# Altium schematic sheet debugging_board_3_MCU.SchDoc
size A4
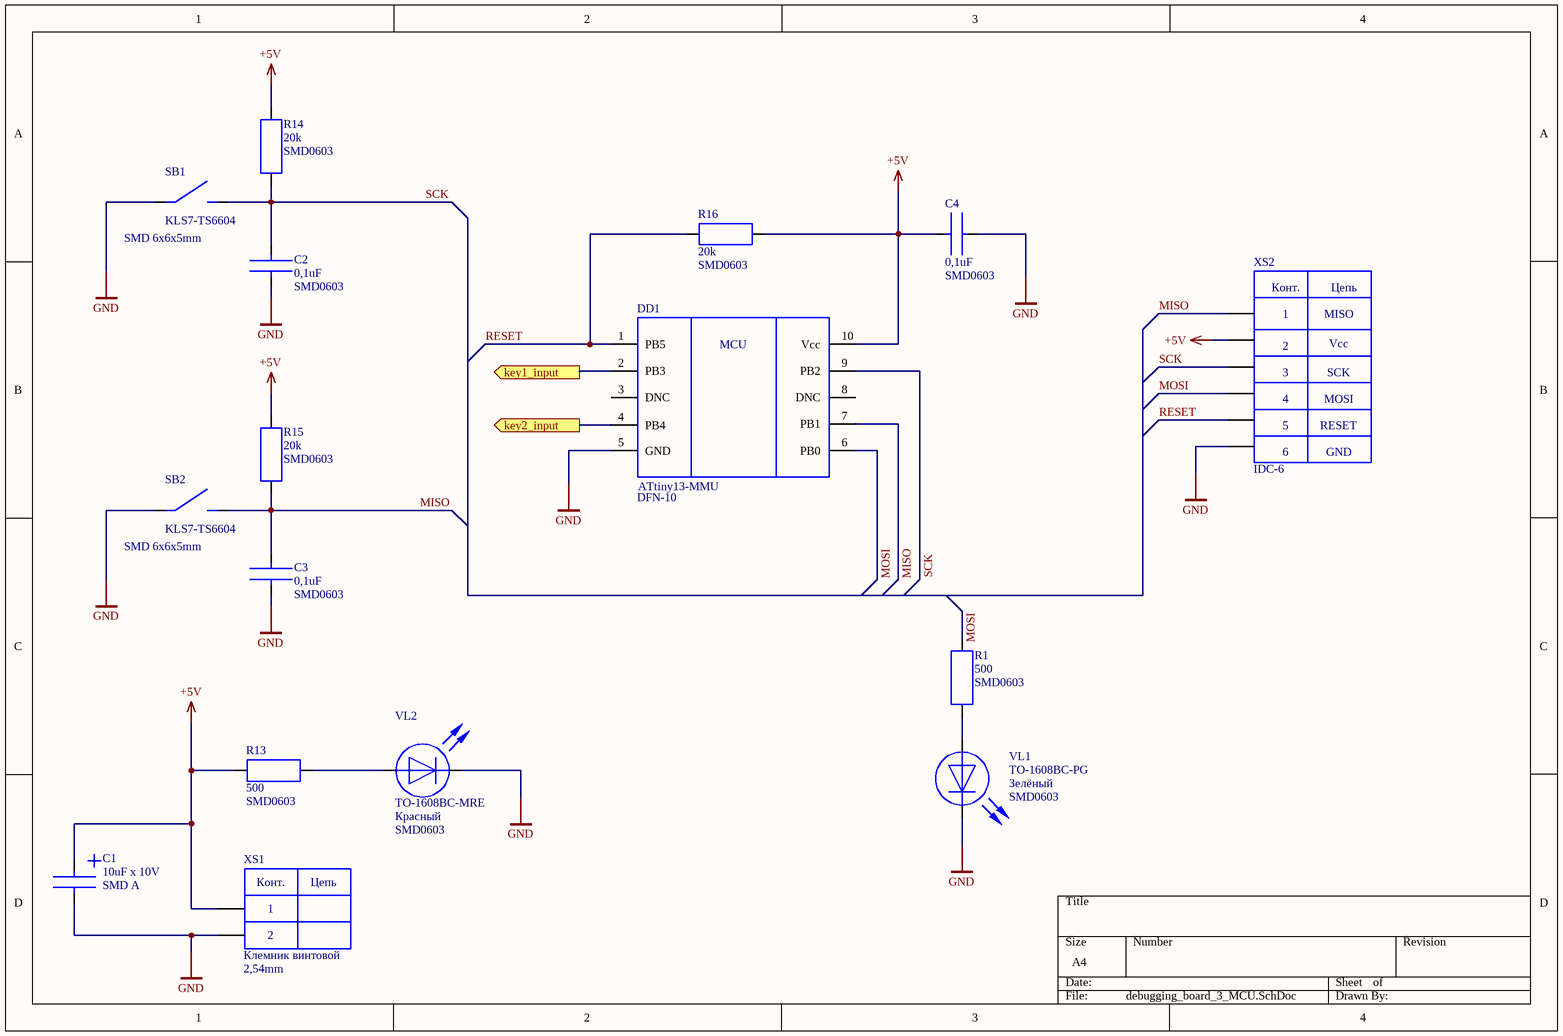
[diagram p0: debugging_board_3_MCU.SchDoc]

## Parts
C1  10uF x 10V  Package: SMD A  [TANT_CAP_A(3216)]
C2  0,1uF  Package: SMD0603  [SMD0603(1005)]
C3  0,1uF  Package: SMD0603  [SMD0603(1005)]
C4  0,1uF  Package: SMD0603  [SMD0603(1005)]
DD1  ATtiny13-MMU  Package: DFN-10  [QFN-10]
R1  500  Package: SMD0603  [SMD0603(1005)]
R13  500  Package: SMD0603  [SMD0603(1005)]
R14  20k  Package: SMD0603  [SMD0603(1005)]
R15  20k  Package: SMD0603  [SMD0603(1005)]
R16  20k  Package: SMD0603  [SMD0603(1005)]
SB1  KLS7-TS6604  Package: SMD 6х6х5mm  [KLS7-TS6604 (IT-1102SA)]
SB2  KLS7-TS6604  Package: SMD 6х6х5mm  [KLS7-TS6604 (IT-1102SA)]
VL1  TO-1608BC-PG  Light: Зелёный  Package: SMD0603  [LED_SMD0603(1005)]
VL2  TO-1608BC-MRE  Light: Красный  Package: SMD0603  [LED_SMD0603(1005)]
XS1  Клемник винтовой  Package: 2,54mm  [XS_2x2.54MM]
XS2  IDC-6  [IDC-6 (2.54)]

## Ports
key1_input (out), key2_input (out)

## Nets
+5V: C1.1 C4.1 DD1.10(Vcc) R13.1 R14.2 R15.2 R16.2 XS1.1 XS2.2(DM-)
GND: C1.2 C2.1 C3.1 C4.2 DD1.5(GND) SB1.1 SB2.1 VL1.2 VL2.2 XS1.2 XS2.6(DM+)
key1_input: DD1.2(PB3) ; port key1_input
key2_input: DD1.4(PB4) ; port key2_input
MISO: C3.2 DD1.7(PB1) R15.1 SB2.2 XS2.1(+5)
MOSI: DD1.6(PB0) R1.2 XS2.4(DM+)
RESET: DD1.1(PB5) R16.1 XS2.5(DM+)
SCK: C2.2 DD1.9(PB2) R14.1 SB1.2 XS2.3(DM+)
NetR1_1: R1.1 VL1.1
NetR13_2: R13.2 VL2.1

Not connected (* = marked no-connect by the designer): DD1 3(DNC) 8(DNC)

## Notes on the sheet
- (in symbol ATtiny13-MMU) MCU
- (in symbol ISP_connector) Конт.; Цепь; MISO; Vcc; SCK; MOSI; RESET; GND
- (in symbol Клемник винтовой 2-контактный, 2,54мм) Конт.; Цепь

## Library data of the parts
C1 = C_TANT_A: Type: C; ValueBOM: Конденсатор танталовый 10мкФ х 10В SMD A; Value: 10uF x 10V
C2-C4 = CER_CUP_0603: Type: C; ValueBOM: Конденсатор керамический 0,1мкФ SMD 0603 1%; Value: 0,1uF
DD1 = ATtiny13-MMU: ValueBOM: Микроконтроллер ATtiny13-MMU; Type: DD; Value: ATtiny13-MMU
R1 R13 = R_0603: ValueBOM: Резистор 500 Ом SMD 0603 1%; Type: R; Value: 500
R14-R16 = R_0603: ValueBOM: Резистор 20кОм SMD 0603 1%; Type: R; Value: 20k
SB1 SB2 = Кнопка KLS7-TS6604 (IT-1102SA): ValueBOM: KLS7-TS6604-5.0-180 (IT-1102SA), Кнопка тактовая 6х6х5мм SMD; Type: SB; Value: KLS7-TS6604
VL1 = LED_0603: ValueBOM: Светодиод Зелёный TO-1608BC-PG SMD0603; Type: VL; Value: TO-1608BC-PG
VL2 = LED_0603: ValueBOM: Светодиод Красный TO-1608BC-MRE SMD0603; Type: VL; Value: TO-1608BC-MRE
XS1 = Клемник винтовой 2-контактный, 2,54мм: ValueBOM: 308-021-14, Клеммник винтовой, 2-контактный, 2.54мм, прямой; Type: XS; Value: Клемник винтовой
XS2 = ISP_connector: Value: IDC-6